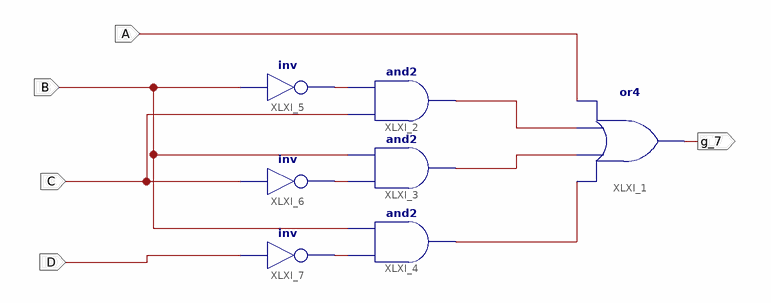
[diagram p0: schematic sheet 1]
// Xilinx ISE schematic bcd_for_g.sch (spartan6) as structural Verilog: 7 symbols, 5 ports
module bcd_for_g (
  input  A,
  input  B,
  input  C,
  input  D,
  output g_7
);

  wire XLXN_1, XLXN_2, XLXN_3, XLXN_11, XLXN_12, XLXN_13;

  or XLXI_1 (g_7, XLXN_13, XLXN_12, XLXN_11, A);
  and XLXI_4 (XLXN_13, XLXN_3, B);
  not XLXI_7 (XLXN_3, D);
  not XLXI_6 (XLXN_2, C);
  and XLXI_3 (XLXN_12, XLXN_2, B);
  and XLXI_2 (XLXN_11, C, XLXN_1);
  not XLXI_5 (XLXN_1, B);
endmodule
